# EAGLE schematic breakouts (EAGLE 5.11)
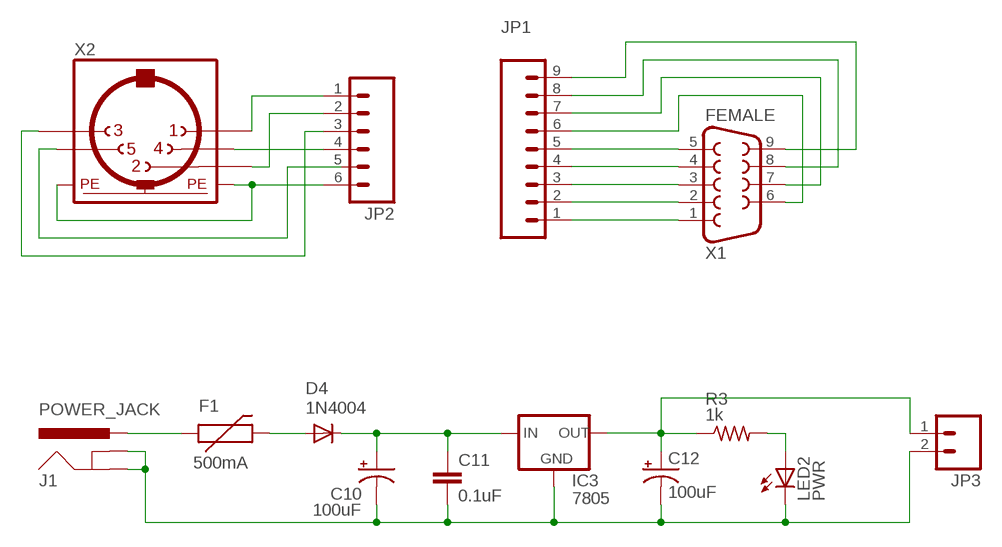
[diagram p0: schematic, sheet 1]

## Parts
C10  100uF  CAP_POLPTH1  [CPOL-RADIAL-100UF-25V]
C11  0.1uF  CAPPTH2  [CAP-PTH-SMALL2]
C12  100uF  CAP_POLPTH1  [CPOL-RADIAL-100UF-25V]
D4  1N4004  DIODEPTH  [DIODE-1N4001]
F1  500mA  PTCPTH  [PTC]
IC3  7805  78XXS  [78XXS]
J1  POWER_JACK  POWER_JACKPTH_LOCK  [POWER_JACK_PTH_LOCK]
JP1  M09LOCK  [1X09_LOCK]
JP2  M06LOCK  [1X06_LOCK]
JP3  M02PTH  [1X02]
LED2  PWR  LED3MM  [LED3MM]
R3  1k  R-US_0309/V  [0309V]
X1  FEMALE  DB9FEMALE  [DB9]
X2  DIN-5-FEMALE  [DIN-5-PTH]

## Nets
N$1: JP1.1 X1.1
N$2: JP1.2 X1.2
N$3: JP1.3 X1.3
N$4: JP1.4 X1.4
N$5: JP1.5 X1.5
N$6: JP1.6 X1.6
N$7: JP1.7 X1.7
N$8: JP1.8 X1.8
N$9: JP1.9 X1.9
N$10: JP2.1 X2.1
N$11: JP2.4 X2.4
N$12: JP2.2 X2.2
N$13: JP2.6 X2.PE X2.PE@(PE)
N$14: LED2.A R3.2
N$15: X2.5
N$16: JP2.3 X2.3
N$17: F1.P$1 J1.PWR
N$18: D4.A F1.P$2
N$19: C12.1(+) IC3.OUT JP3.1 R3.1
N$20: C10.2(-) C11.2 C12.2(-) IC3.GND J1.GND J1.GNDBREAK JP3.2 LED2.K(C)
VIN: C10.1(+) C11.1 D4.C IC3.IN
Unconnected: JP2.5

## Library data of the parts
C10 C12 = SparkFun:CAP_POL: Capacitor Polarized These are standard SMD and PTH capacitors. Normally 10uF, 47uF, and 100uF in electrolytic and tantalum varieties. Always verify the external diameter of the through hole cap, it varies with capacity, voltage, and manufacturer. The EIA devices should be standard.
C11 = SparkFun:CAP: Capacitor Standard 0603 ceramic capacitor, and 0.1" leaded capacitor.
D4 = SparkFun:DIODE: Diode These are standard reverse protection diodes and small signal diodes. SMA package can handle up to about 1A. SOD-323 can handle about 200mA. What the SOD-323 package when ordering, there are some mfgs out there that are 5-pin packages.
F1 = SparkFun:PTC: Resettable Fuse PTC Resettable Fuse. Spark Fun Electronics SKU : COM-08357
IC3 = v-reg:78XXS: VOLTAGE REGULATOR
J1 = SparkFun:POWER_JACK: Power Jack This is the standard 5.5mm barrel jack for power. The PTH is the most common, proven, reliable, footprint. All others are experimental. The Slot footprint only works if the mill layer is transmitted to the PCB fab house so be warned. Spark Fun Electronics SKU : PRT-00119. Mating wall wart : TOL-00298 (and others)
JP1 = SparkFun:M09: Header 9 Standard 9-pin 0.1" header. Use with straight break away headers (SKU : PRT-00116), right angle break away headers (PRT-00553), swiss pins (PRT-00743), machine pins (PRT-00117), and female headers (PRT-00115).
JP2 = SparkFun:M06: Header 6 Standard 6-pin 0.1" header. Use with straight break away headers (SKU : PRT-00116), right angle break away headers (PRT-00553), swiss pins (PRT-00743), machine pins (PRT-00117), and female headers (PRT-00115). Molex polarized connector foot print use with SKU : PRT-08094 with associated crimp pins and housings. NOTES ON THE VARIANTS LOCK and LOCK_LONGPADS... This footprint was designed to help hold the alignment of a through-hole component (i.e. 6-pin header) while soldering it into place. You may notice that each hole has been shifted either up or down by 0.005 of an inch from it's more standard position (which is a perfectly straight line). This slight alteration caused the pins (the squares in the middle) to touch the edges of the holes. Because they are alternating, it causes a "brace" to hold the component in place. 0.005 has proven to be the perfect amount of "off-center" position when using our standard breakaway headers. Although looks a little odd when you look at the bare footprint, once you have a header in there, the alteration is very hard to notice. Also, if you push a header all the way into place, it is covered up entirely on the bottom side. This idea of altering the position of holes to aid alignment will be further integrated into the Sparkfun Library for other footprints. It can help hold any component with 3 or more connection pins.
JP3 = SparkFun:M02: Header 2 Standard 2-pin 0.1" header. Use with straight break away headers (SKU : PRT-00116), right angle break away headers (PRT-00553), swiss pins (PRT-00743), machine pins (PRT-00117), and female headers (PRT-00115). Molex polarized connector foot print use with SKU : PRT-08233 with associated crimp pins and housings.
LED2 = SparkFun:LED: LEDs Standard schematic elements and footprints for 5mm, 3mm, 1206, and 0603 sized LEDs. 5mm - Spark Fun Electronics SKU : COM-00529 (and others)
R3 = resistor:R-US_: RESISTOR, American symbol
X1 = SparkFun:DB9: DB9 Connector Standard DB9 (D-Sub 9) serial connector. Can be used for CAN bus as well as RS485 and RS232. Footprint production proven. Spark Fun Electronics SKU : PRT-00429
X2 = zencoding:DIN-5-FEMALE: Female DIN-5 90-degree PCB Through-Hole 5 pins 90 deg. with shield, horizontal (DIN 41524) Compatible with Sparkfun Part: PRT-09536 Compatible with Jaycar Part: PS0350; JAYCAR: PS0350; SPARKFUN: PRT-09536